# EAGLE schematic altair_sch (EAGLE 9.7.0)
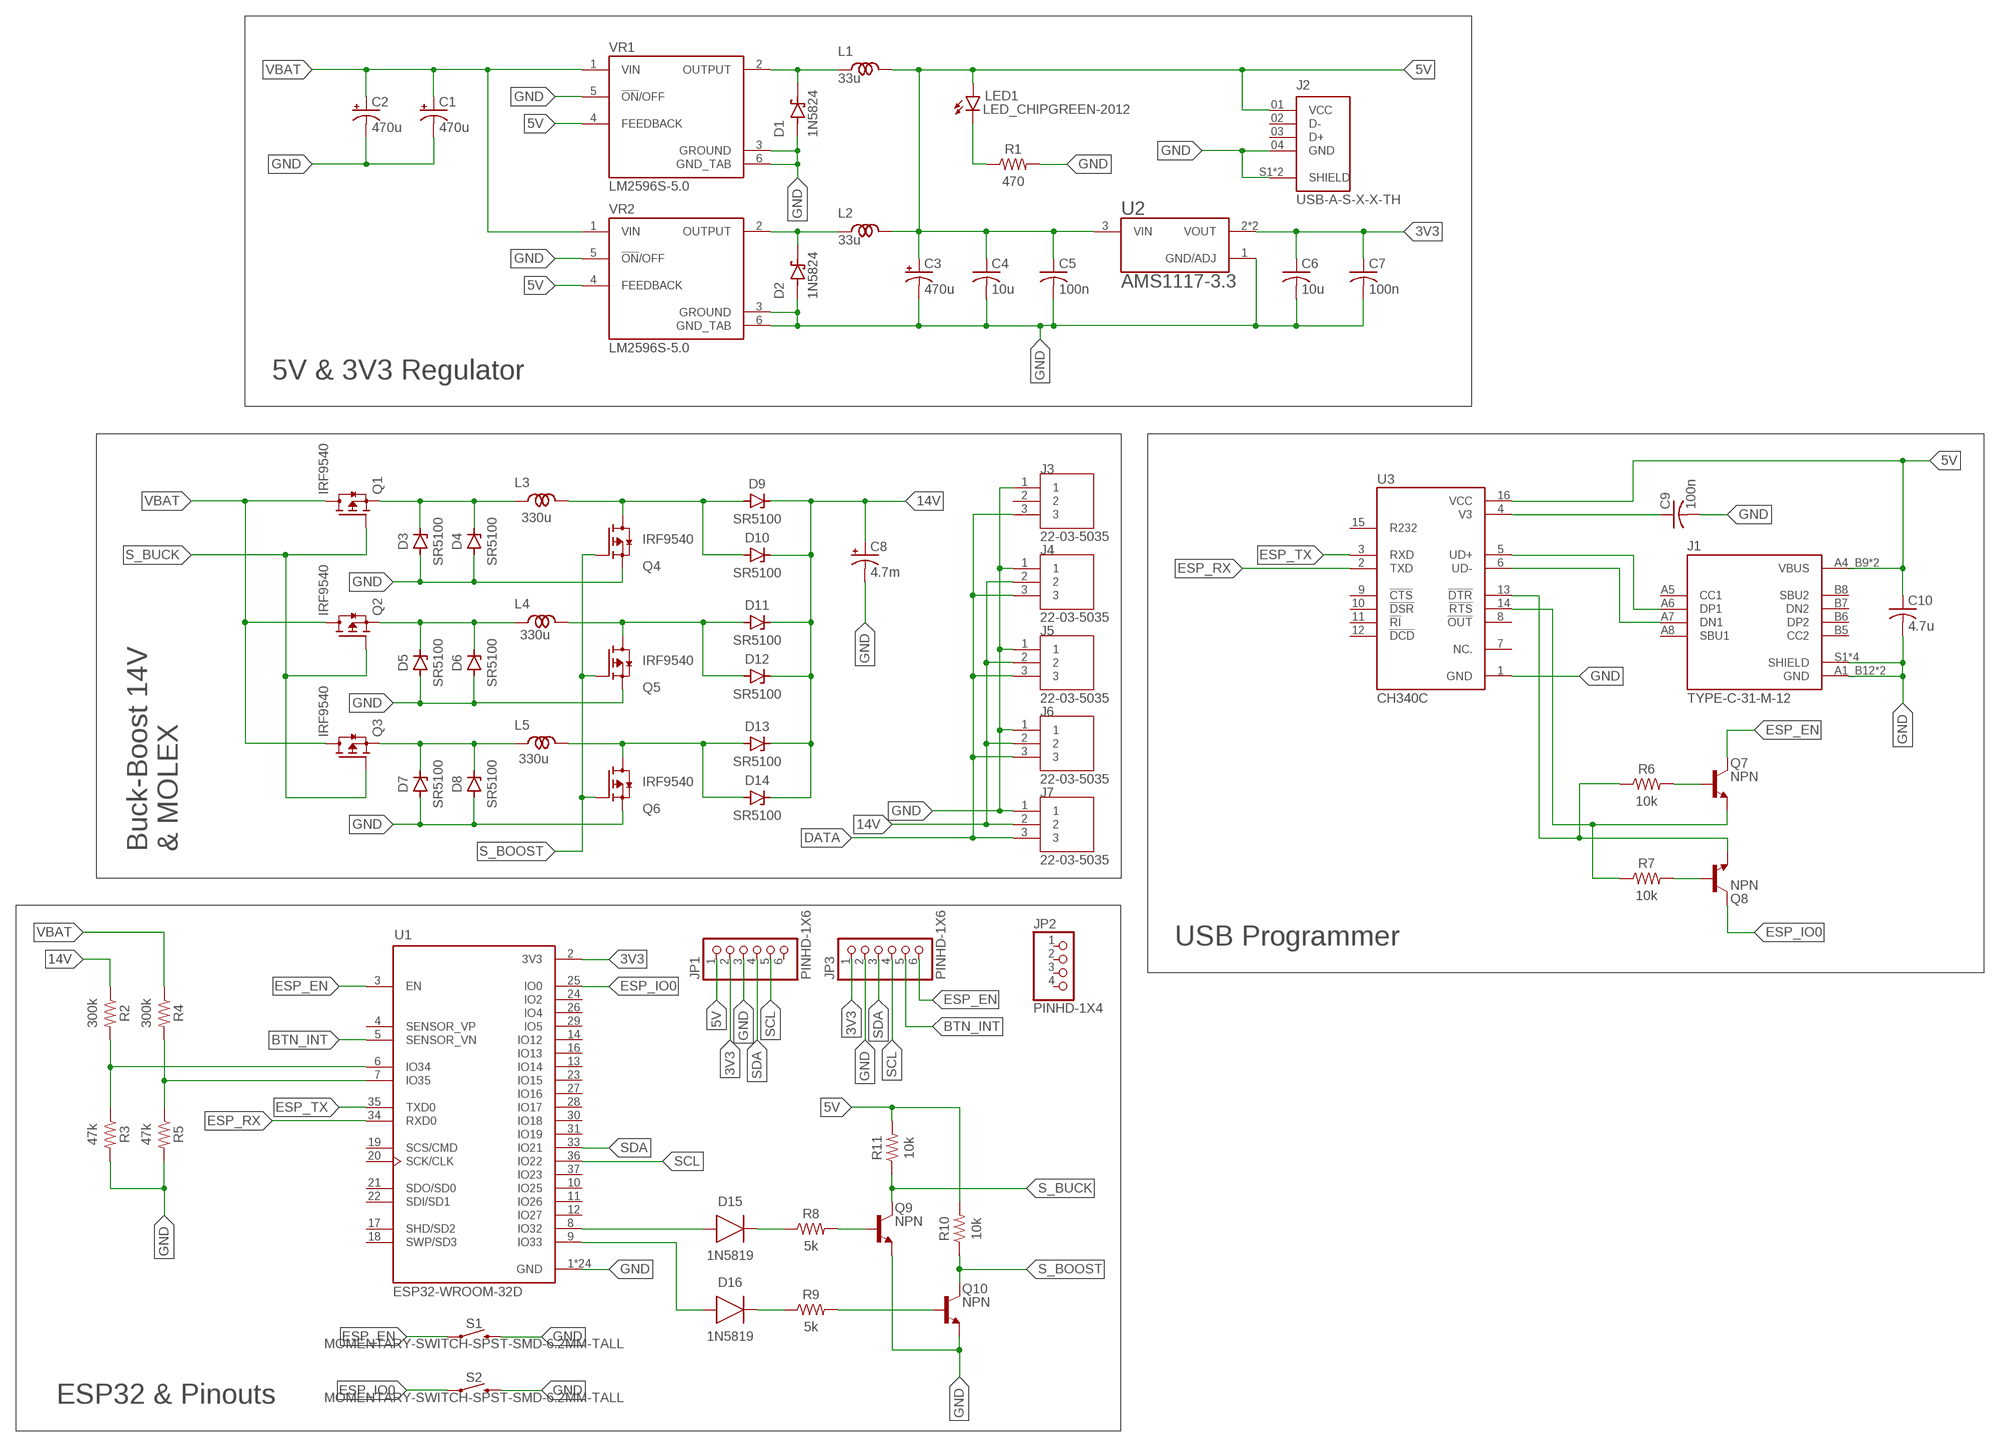
[diagram p0: schematic, sheet 1]

## Parts
C1  470u  C-POL-US_ECAP-10.5MM  [CAPAE1030X1050N]
C2  470u  C-POL-US_ECAP-10.5MM  [CAPAE1030X1050N]
C3  470u  C-POL-US_ECAP-10.5MM  [CAPAE1030X1050N]
C4  10u  C-US_CHIP-0805(2012-METRIC)  [CAPC2012X110]
C5  100n  C-US_CHIP-0805(2012-METRIC)  [CAPC2012X110]
C6  10u  C-US_CHIP-0805(2012-METRIC)  [CAPC2012X110]
C7  100n  C-US_CHIP-0805(2012-METRIC)  [CAPC2012X110]
C8  4.7m  C-POL-US_RADIAL-20MM-DIA  [CAPPRD550W60D1200H2000B]
C9  100n  C-US_CHIP-0805(2012-METRIC)  [CAPC2012X110]
C10  4.7u  C-US_CHIP-0805(2012-METRIC)  [CAPC2012X110]
D1  1N5824  SS54FSH  [SODFL4725X110N]
D2  1N5824  SS54FSH  [SODFL4725X110N]
D3  SR5100  ZENERDO-214AC(SMA)  [DIOM5226X290N]
D4  SR5100  ZENERDO-214AC(SMA)  [DIOM5226X290N]
D5  SR5100  ZENERDO-214AC(SMA)  [DIOM5226X290N]
D6  SR5100  ZENERDO-214AC(SMA)  [DIOM5226X290N]
D7  SR5100  ZENERDO-214AC(SMA)  [DIOM5226X290N]
D8  SR5100  ZENERDO-214AC(SMA)  [DIOM5226X290N]
D9  SR5100  ZENERDO-214AC(SMA)  [DIOM5226X290N]
D10  SR5100  ZENERDO-214AC(SMA)  [DIOM5226X290N]
D11  SR5100  ZENERDO-214AC(SMA)  [DIOM5226X290N]
D12  SR5100  ZENERDO-214AC(SMA)  [DIOM5226X290N]
D13  SR5100  ZENERDO-214AC(SMA)  [DIOM5226X290N]
D14  SR5100  ZENERDO-214AC(SMA)  [DIOM5226X290N]
D15  1N5819  DIODEDO-214AC(SMA)  [DIOM5226X290N]
D16  1N5819  DIODEDO-214AC(SMA)  [DIOM5226X290N]
J1  TYPE-C-31-M-12  [HRO_TYPE-C-31-M-12]
J2  USB-A-S-X-X-TH  [SAMTEC_USB-A-S-X-X-TH]
J3  22-03-5035  [MOLEX_22-03-5035]
J4  22-03-5035  [MOLEX_22-03-5035]
J5  22-03-5035  [MOLEX_22-03-5035]
J6  22-03-5035  [MOLEX_22-03-5035]
J7  22-03-5035  [MOLEX_22-03-5035]
JP1  PINHD-1X6  [1X06]
JP2  PINHD-1X4  [1X04]
JP3  PINHD-1X6  [1X06]
L1  33u  CDRH127R  [CDRH127R]
L2  33u  CDRH127R  [CDRH127R]
L3  330u  CDRH127R  [CDRH127R]
L4  330u  CDRH127R  [CDRH127R]
L5  330u  CDRH127R  [CDRH127R]
LED1  LED_CHIPGREEN-2012  [LEDC2012X110N_G]
Q1  IRF9540  [TO254P1052X465X1989-3]
Q2  IRF9540  [TO254P1052X465X1989-3]
Q3  IRF9540  [TO254P1052X465X1989-3]
Q4  IRF9540  [TO254P1052X465X1989-3]
Q5  IRF9540  [TO254P1052X465X1989-3]
Q6  IRF9540  [TO254P1052X465X1989-3]
Q7  NPN  NPN_SOT23-BEC  [SOT95P237X112-3N]
Q8  NPN  NPN_SOT23-BEC  [SOT95P237X112-3N]
Q9  NPN  NPN_SOT23-BEC  [SOT95P237X112-3N]
Q10  NPN  NPN_SOT23-BEC  [SOT95P237X112-3N]
R1  470  R-US_CHIP-0805(2012-METRIC)  [RESC2012X65]
R2  300k  R-US_CHIP-0805(2012-METRIC)  [RESC2012X65]
R3  47k  R-US_CHIP-0805(2012-METRIC)  [RESC2012X65]
R4  300k  R-US_CHIP-0805(2012-METRIC)  [RESC2012X65]
R5  47k  R-US_CHIP-0805(2012-METRIC)  [RESC2012X65]
R6  10k  R-US_CHIP-0805(2012-METRIC)  [RESC2012X65]
R7  10k  R-US_CHIP-0805(2012-METRIC)  [RESC2012X65]
R8  5k  R-US_CHIP-0805(2012-METRIC)  [RESC2012X65]
R9  5k  R-US_CHIP-0805(2012-METRIC)  [RESC2012X65]
R10  10k  R-US_CHIP-0805(2012-METRIC)  [RESC2012X65]
R11  10k  R-US_CHIP-0805(2012-METRIC)  [RESC2012X65]
S1  MOMENTARY-SWITCH-SPST-SMD-6.2MM-TALL  [TACTILE_SWITCH_SMD_6.2MM_TALL]
S2  MOMENTARY-SWITCH-SPST-SMD-6.2MM-TALL  [TACTILE_SWITCH_SMD_6.2MM_TALL]
U1  ESP32-WROOM-32D  [MODULE_ESP32-WROOM-32D]
U2  AMS1117-3.3  [SOT229P700X180-4N]
U3  CH340C  [SOIC127P600X180-16N]
VR1  LM2596S-5.0  [TO170P1524X483-6N]
VR2  LM2596S-5.0  [TO170P1524X483-6N]

## Nets
3V3: C6.1 C7.1 JP1.2 JP3.1 U1.2(3V3) U2.2(VOUT) U2.4(VOUT)
5V: C3.1(+) C4.1 C5.1 C10.1 J1.A4_B9(VBUS) J1.B4_A9(VBUS) J2.01(VCC) JP1.1 L1.P$2 L2.P$2 LED1.2(A) R10.2 R11.2 U2.3(VIN) U3.16(VCC) VR1.4(FEEDBACK) VR2.4(FEEDBACK)
14V: C8.1(+) D9.1(C) D10.1(C) D11.1(C) D12.1(C) D13.1(C) D14.1(C) J4.2 J5.2 J6.2 J7.2 R2.1
BTN_INT: JP3.5 U1.5(SENSOR_VN)
DATA: J3.3 J4.3 J5.3 J6.3 J7.3
ESP_EN: JP3.6 Q7.3(C) S1.A2 U1.3(EN)
ESP_IO0: Q8.3(C) S2.A2 U1.25(IO0)
ESP_RX: U1.34(RXD0) U3.2(TXD)
ESP_TX: U1.35(TXD0) U3.3(RXD)
GND: C1.2(-) C2.2(-) C3.2(-) C4.2 C5.2 C6.2 C7.2 C8.2(-) C9.2 C10.2 D1.A D2.A D3.2(A) D4.2(A) D5.2(A) D6.2(A) D7.2(A) D8.2(A) J1.A1_B12(GND) J1.B1_A12(GND) J1.S1(SHIELD) J1.S2(SHIELD) J1.S3(SHIELD) J1.S4(SHIELD) J2.04(GND) J2.S1(SHIELD) J2.S2(SHIELD) J3.1 J4.1 J5.1 J6.1 J7.1 JP1.3 JP3.2 Q4.3(S) Q5.3(S) Q6.3(S) Q9.2(E) Q10.2(E) R1.2 R3.2 R5.2 S1.B2 S2.B2 U1.1(GND) U1.15(GND) U1.38(GND) U1.39_1(GND) U1.39_2(GND) U1.39_3(GND) U1.39_4(GND) U1.39_5(GND) U1.39_6(GND) U1.39_7(GND) U1.39_8(GND) U1.39_9(GND) U1.39_10(GND) U1.39_11(GND) U1.39_12(GND) U1.39_13(GND) U1.39_14(GND) U1.39_15(GND) U1.39_16(GND) U1.39_17(GND) U1.39_18(GND) U1.39_19(GND) U1.39_20(GND) U1.39_21(GND) U2.1(GND/ADJ) U3.1(GND) VR1.3(GROUND) VR1.5(!ON!/OFF) VR1.6(GND_TAB) VR2.3(GROUND) VR2.5(!ON!/OFF) VR2.6(GND_TAB)
N$1: D1.C(K) L1.P$1 VR1.2(OUTPUT)
N$2: LED1.1(C) R1.1
N$3: D3.1(C) D4.1(C) L3.P$1 Q1.3(S)
N$4: D2.C(K) L2.P$1 VR2.2(OUTPUT)
N$5: D5.1(C) D6.1(C) L4.P$1 Q2.3(S)
N$6: D7.1(C) D8.1(C) L5.P$1 Q3.3(S)
N$7: D9.2(A) D10.2(A) L3.P$2 Q4.2(D)
N$8: D11.2(A) D12.2(A) L4.P$2 Q5.2(D)
N$9: D13.2(A) D14.2(A) L5.P$2 Q6.2(D)
N$10: R4.2 R5.1 U1.7(IO35)
N$11: R2.2 R3.1 U1.6(IO34)
N$12: C9.1 U3.4(V3)
N$13: J1.A6(DP1) U3.5(UD+)
N$14: J1.A7(DN1) U3.6(UD-)
N$15: Q7.2(E) R7.1 U3.14(!RTS)
N$16: Q8.2(E) R6.1 U3.13(!DTR)
N$17: Q7.1(B) R6.2
N$18: Q8.1(B) R7.2
N$19: D15.2(A) U1.8(IO32)
N$20: D15.1(C) R8.1
N$21: D16.2(A) U1.9(IO33)
N$22: D16.1(C) R9.1
N$23: Q10.1(B) R9.2
N$24: Q9.1(B) R8.2
S_BOOST: Q4.1(G) Q5.1(G) Q6.1(G) Q10.3(C) R10.1
S_BUCK: Q1.1(G) Q2.1(G) Q3.1(G) Q9.3(C) R11.1
SCL: JP1.5 JP3.4 U1.36(IO22)
SDA: JP1.4 JP3.3 U1.33(IO21)
VBAT: C1.1(+) C2.1(+) Q1.2(D) Q2.2(D) Q3.2(D) R4.1 VR1.1(VIN) VR2.1(VIN)
Unconnected: J1.A5(CC1) J1.A8(SBU1) J1.B5(CC2) J1.B6(DP2) J1.B7(DN2) J1.B8(SBU2) J2.02(D-) J2.03(D+) J3.2 JP1.6 JP2.1 JP2.2 JP2.3 JP2.4 U1.4(SENSOR_VP) U1.10(IO25) U1.11(IO26) U1.12(IO27) U1.13(IO14) U1.14(IO12) U1.16(IO13) U1.17(SHD/SD2) U1.18(SWP/SD3) U1.19(SCS/CMD) U1.20(SCK/CLK) U1.21(SDO/SD0) U1.22(SDI/SD1) U1.23(IO15) U1.24(IO2) U1.26(IO4) U1.27(IO16) U1.28(IO17) U1.29(IO5) U1.30(IO18) U1.31(IO19) U1.37(IO23) U3.7(NC.) U3.8(!OUT) U3.9(!CTS) U3.10(!DSR) U3.11(!RI) U3.12(!DCD) U3.15(R232)

## Notes on the sheet
- 5V & 3V3 Regulator
- Buck-Boost 14V
  & MOLEX
- USB Programmer
- ESP32 & Pinouts

## Library data of the parts
C1-C3 C8 = Capacitor:C-POL-US: Capacitor Polarised - ANSI; CATEGORY: Capacitor
C4-C7 C9 C10 = Capacitor:C-US: Capacitor - ANSI; CATEGORY: Capacitor
D1 D2 = MY-SS54:SS54FSH: Check availability <https://pricing.snapeda.com/parts/SS54FSH/Taiwan%20Semiconductor/view-part?ref=eda>; AVAILABILITY: In Stock; CHECK_PRICES: https://www.snapeda.com/parts/SS54FSH/Taiwan+Semiconductor/view-part/?ref=eda; DESCRIPTION: 5A, 40V, Schottky Rectifier; MF: Taiwan Semiconductor; MP: SS54FSH; PACKAGE: SOD-128-2 Taiwan Semiconductor; PRICE: None; SNAPEDA_LINK: https://www.snapeda.com/parts/SS54FSH/Taiwan+Semiconductor/view-part/?ref=snap
D3-D14 = Diode:ZENER: Zener Diode - Generic; CATEGORY: Diode; SUB-CATEGORY: Zener; VALUE: ZENER
D15 D16 = Diode:DIODE: Diode Rectifier - Generic; CATEGORY: Diode; SUB-CATEGORY: Rectifier; VALUE: DIODE
J1 = MY-USB-TYPE-C:TYPE-C-31-M-12: Check availability <https://pricing.snapeda.com/parts/TYPE-C-31-M-12/HRO%20Electronics%20Co.%2C%20Ltd./view-part?ref=eda>; AVAILABILITY: Not in stock; CHECK_PRICES: https://www.snapeda.com/parts/TYPE-C-31-M-12/HRO+Electronics+Co.%252C+Ltd./view-part/?ref=eda; DESCRIPTION: USB Connectors 24 Receptacle 1 8.94*7.3mm RoHS; MF: HRO Electronics Co., Ltd.; MP: TYPE-C-31-M-12; PACKAGE: Package; PRICE: None; SNAPEDA_LINK: https://www.snapeda.com/parts/TYPE-C-31-M-12/HRO+Electronics+Co.%252C+Ltd./view-part/?ref=snap
J2 = MY-USB-TYPE-A:USB-A-S-X-X-TH: USB-A (USB TYPE-A) USB 2.0 Receptacle Connector 4 Position Through Hole, Right Angle Check availability <https://pricing.snapeda.com/parts/USB-A-S-S-W-TH/Samtec/view-part?ref=eda>; AVAILABILITY: In Stock; CHECK_PRICES: https://www.snapeda.com/parts/USB-A-S-S-W-TH/Samtec+Inc./view-part/?ref=eda; DESCRIPTION: USB-A (USB TYPE-A) USB 2.0 Receptacle Connector 4 Position Through Hole, Right Angle; MF: Samtec; MP: USB-A-S-S-W-TH; PACKAGE: None; PRICE: None; SNAPEDA_LINK: https://www.snapeda.com/parts/USB-A-S-S-W-TH/Samtec+Inc./view-part/?ref=snap
J3-J7 = MOLEX-22-03-5035:22-03-5035: 2.50mm Pitch SPOX™ Wire-to-Board Header, Vertical, Shrouded, 3 Circuits, Tin (Sn) Plating Check availability <https://pricing.snapeda.com/parts/22-03-5035/Molex/view-part?ref=eda>; AVAILABILITY: In Stock; CHECK_PRICES: https://www.snapeda.com/parts/22-03-5035/Molex/view-part/?ref=eda; DESCRIPTION: Conn Shrouded Header HDR 3 POS 2.5mm Solder ST Thru-Hole Bag | Molex Incorporated 22-03-5035; MF: Molex; MP: 22-03-5035; PACKAGE: None; PRICE: None; PURCHASE-URL: https://www.snapeda.com/api/url_track_click_mouser/?unipart_id=451887&manufacturer=Molex&part_name=22-03-5035&search_term=22-03-5035; SNAPEDA_LINK: https://www.snapeda.com/parts/22-03-5035/Molex/view-part/?ref=snap
JP1 JP3 = Connector:PINHD-1X6: PIN HEADER; CATEGORY: Headers; DESCRIPTION: Header, Straight, 6 Position; MANUFACTURER: Generic; MPN: Generic; OPERATING_TEMPERATURE: Generic; PART_STATUS: Active; PITCH: 0.100" (2.54mm); ROHS_COMPLIANCE: Generic; SERIES: Generic; SUB-CATEGORY: Headers, Male Pins; TYPE: Board to Board or Cable, Unshrouded, Through Hole, Straight
JP2 = Connector:PINHD-1X4: PIN HEADER; CATEGORY: Headers; DESCRIPTION: Header, Straight, 4 Position; MANUFACTURER: Generic; MPN: Generic; OPERATING_TEMPERATURE: Generic; PART_STATUS: Active; PITCH: 0.100" (2.54mm); ROHS_COMPLIANCE: Generic; SERIES: Generic; SUB-CATEGORY: Headers, Male Pins; TYPE: Board to Board or Cable, Unshrouded, Through Hole, Straight
L1-L5 = MY-CDRH127R:CDRH127R
LED1 = Tutorial - Fusion 360:LED_CHIP: LED - Generic; CATEGORY: Opto-Electronic; COLOR: Green; SUB-CATEGORY: LED
Q1-Q6 = MY-IRF9540:IRF9540: Trans MOSFET P-CH 100V 6.8A 3-Pin(3+Tab) TO-220AB Check availability <https://pricing.snapeda.com/parts/IRF9540/Vishay%20Siliconix/view-part?ref=eda>; AVAILABILITY: In Stock; CHECK_PRICES: https://www.snapeda.com/parts/IRF9540/Vishay+Siliconix/view-part/?ref=eda; DESCRIPTION: P-Channel 100 V 19A (Tc) 3.7W (Ta), 150W (Tc) Surface Mount D²PAK (TO-263); MF: Vishay Siliconix; MP: IRF9540; PACKAGE: TO-220-3 Vishay; PRICE: None; PURCHASE-URL: https://www.snapeda.com/api/url_track_click_mouser/?unipart_id=1087953&manufacturer=Vishay Siliconix&part_name=IRF9540&search_term=None; SNAPEDA_LINK: https://www.snapeda.com/parts/IRF9540/Vishay+Siliconix/view-part/?ref=snap
Q7-Q10 = Transistor:NPN: NPN - Generic; CATEGORY: Transistor; SUB-CATEGORY: BJT; TYPE: NPN
R1-R11 = Resistor:R-US: Resistor Fixed - ANSI; CATEGORY: Resistor; SUB-CATEGORY: Fixed
S1 S2 = SparkFun-Switches:MOMENTARY-SWITCH-SPST: Momentary Switch (Pushbutton) - SPST Normally-open (NO) SPST momentary switches (buttons, pushbuttons). Variants PTH-12MM - 12mm square, through-hole Momentary Pushbutton Switch - 12mm Square <https://www.sparkfun.com/products/9190> (COM-09190) PTH-6.0MM, PTH-6.0MM-KIT - 6.0mm square, through-hole Mini Pushbutton Switch <https://www.sparkfun.com/products/97> (COM-00097) KIT package intended for soldering kit's - only one side of pads' copper is exposed. PTH-RIGHT-ANGLE-KIT - Right-angle, through-hole Right Angle Tactile Button <https://www.sparkfun.com/products/10791> - Used on SparkFun BigTime Watch Kit <https://www.sparkfun.com/products/11734> SMD-12MM - 12mm square, surface-mount Tactile Button - SMD (12mm) <https://www.sparkfun.com/products/12993> (COM-12993) Used on SparkFun PicoBoard <https://www.sparkfun.com/products/11888> SMD-4.5MM - 4.5mm Square Trackball Switch Used on SparkFun Blackberry Trackballer Breakout <https://www.sparkfun.com/products/13169> SMD-4.6MMX2.8MM - 4.60mm x 2.80mm, surface mount Used on SparkFun Pro Micro - RP2040 <https://www.sparkfun.com/products/17717> SMD-5.2MM, SMD-5.2-REDUNDANT - 5.2mm square, surface-mount Mini Pushbutton Switch - SMD <https://www.sparkfun.com/products/8720> (COM-08720) Used on Arduino Pro Mini <https://www.sparkfun.com/products/11114> REDUNDANT package connects both switch circuits together SMD-6.0X3.5MM - 6.0 x 3.5mm, surface mount Momentary Reset Switch SMD <https://www.sparkfun.com/products/8229> (COM-08229) SMD-6.2MM-TALL - 6.2mm square, surface mount Tactile Button - SMD (6mm) <https://www.sparkfun.com/products/12992> Used on SparkFun Digital Sandbox <https://www.sparkfun.com/products/12651> SMD-RIGHT-ANGLE - Right-angle, surface mount Used on SparkFun Block for Intel® Edison - Arduino <https://www.sparkfun.com/products/13036>; PROD_ID: SWCH-11966; SF_SKU: COM-12992
U1 = MY-ESP32-WROOM-32D:ESP32-WROOM-32D: Bluetooth, WiFi 802.11b/g/n, Bluetooth v4.2 + EDR, Class 1, 2 and 3 Transceiver Module 2.4GHz ~ 2.5GHz Integrated, Trace Surface Mount Check availability <https://pricing.snapeda.com/parts/ESP32-WROOM-32D/Espressif%20Systems/view-part?ref=eda>; AVAILABILITY: In Stock; CHECK_PRICES: https://www.snapeda.com/parts/ESP32-WROOM-32D/Espressif+Systems/view-part/?ref=eda; DESCRIPTION: Bluetooth, WiFi 802.11b/g/n, Bluetooth v4.2 +EDR, Class 1, 2 and 3 Transceiver Module 2.4GHz ~ 2.5GHz Integrated; MF: Espressif Systems; MP: ESP32-WROOM-32D; PACKAGE: Non Standard Espressif Systems; PRICE: None; SNAPEDA_LINK: https://www.snapeda.com/parts/ESP32-WROOM-32D/Espressif+Systems/view-part/?ref=snap
U2 = MY-AMS1117:AMS1117-3.3: Check availability <https://pricing.snapeda.com/parts/AMS1117-3.3/Advanced%20Monolithic%20Systems/view-part?ref=eda>; AVAILABILITY: Not in stock; CHECK_PRICES: https://www.snapeda.com/parts/AMS1117-3.3/Advanced+Monolithic+Systems/view-part/?ref=eda; DESCRIPTION: Sot223/Pkg 1-Amp 3.3-Volt Low Drop Out Voltage Regulatator; MF: Advanced Monolithic Systems; MP: AMS1117-3.3; PACKAGE: SOT-223 Seeed Technology; PRICE: None; SNAPEDA_LINK: https://www.snapeda.com/parts/AMS1117-3.3/Advanced+Monolithic+Systems/view-part/?ref=snap
U3 = MY-CH340C:CH340C: USB to serial chip CH340 Check availability <https://pricing.snapeda.com/parts/CH340C/WCH/view-part?ref=eda>; AVAILABILITY: Not in stock; CHECK_PRICES: https://www.snapeda.com/parts/CH340C/WCH/view-part/?ref=eda; DESCRIPTION: USB to serial chip CH340; MF: WCH; MP: CH340C; PACKAGE: None; PRICE: None; SNAPEDA_LINK: https://www.snapeda.com/parts/CH340C/WCH/view-part/?ref=snap
VR1 VR2 = MY-LM2596S:LM2596S-5.0: Check availability <https://pricing.snapeda.com/parts/LM2596S-5.0/NOPB/Texas%20Instruments/view-part?ref=eda>; AVAILABILITY: In Stock; CHECK_PRICES: https://www.snapeda.com/parts/LM2596S-5.0/NOPB/Texas+Instruments/view-part/?ref=eda; DESCRIPTION: SIMPLE SWITCHER&reg; 4.5V to 40V, 3A Low Component Count Step-Down Regulator; MF: Texas Instruments; MP: LM2596S-5.0/NOPB; PACKAGE: TO-263-5 Texas Instruments; PRICE: None; SNAPEDA_LINK: https://www.snapeda.com/parts/LM2596S-5.0/NOPB/Texas+Instruments/view-part/?ref=snap